# EAGLE design ADC-Board5 (EAGLE 7.7.0)
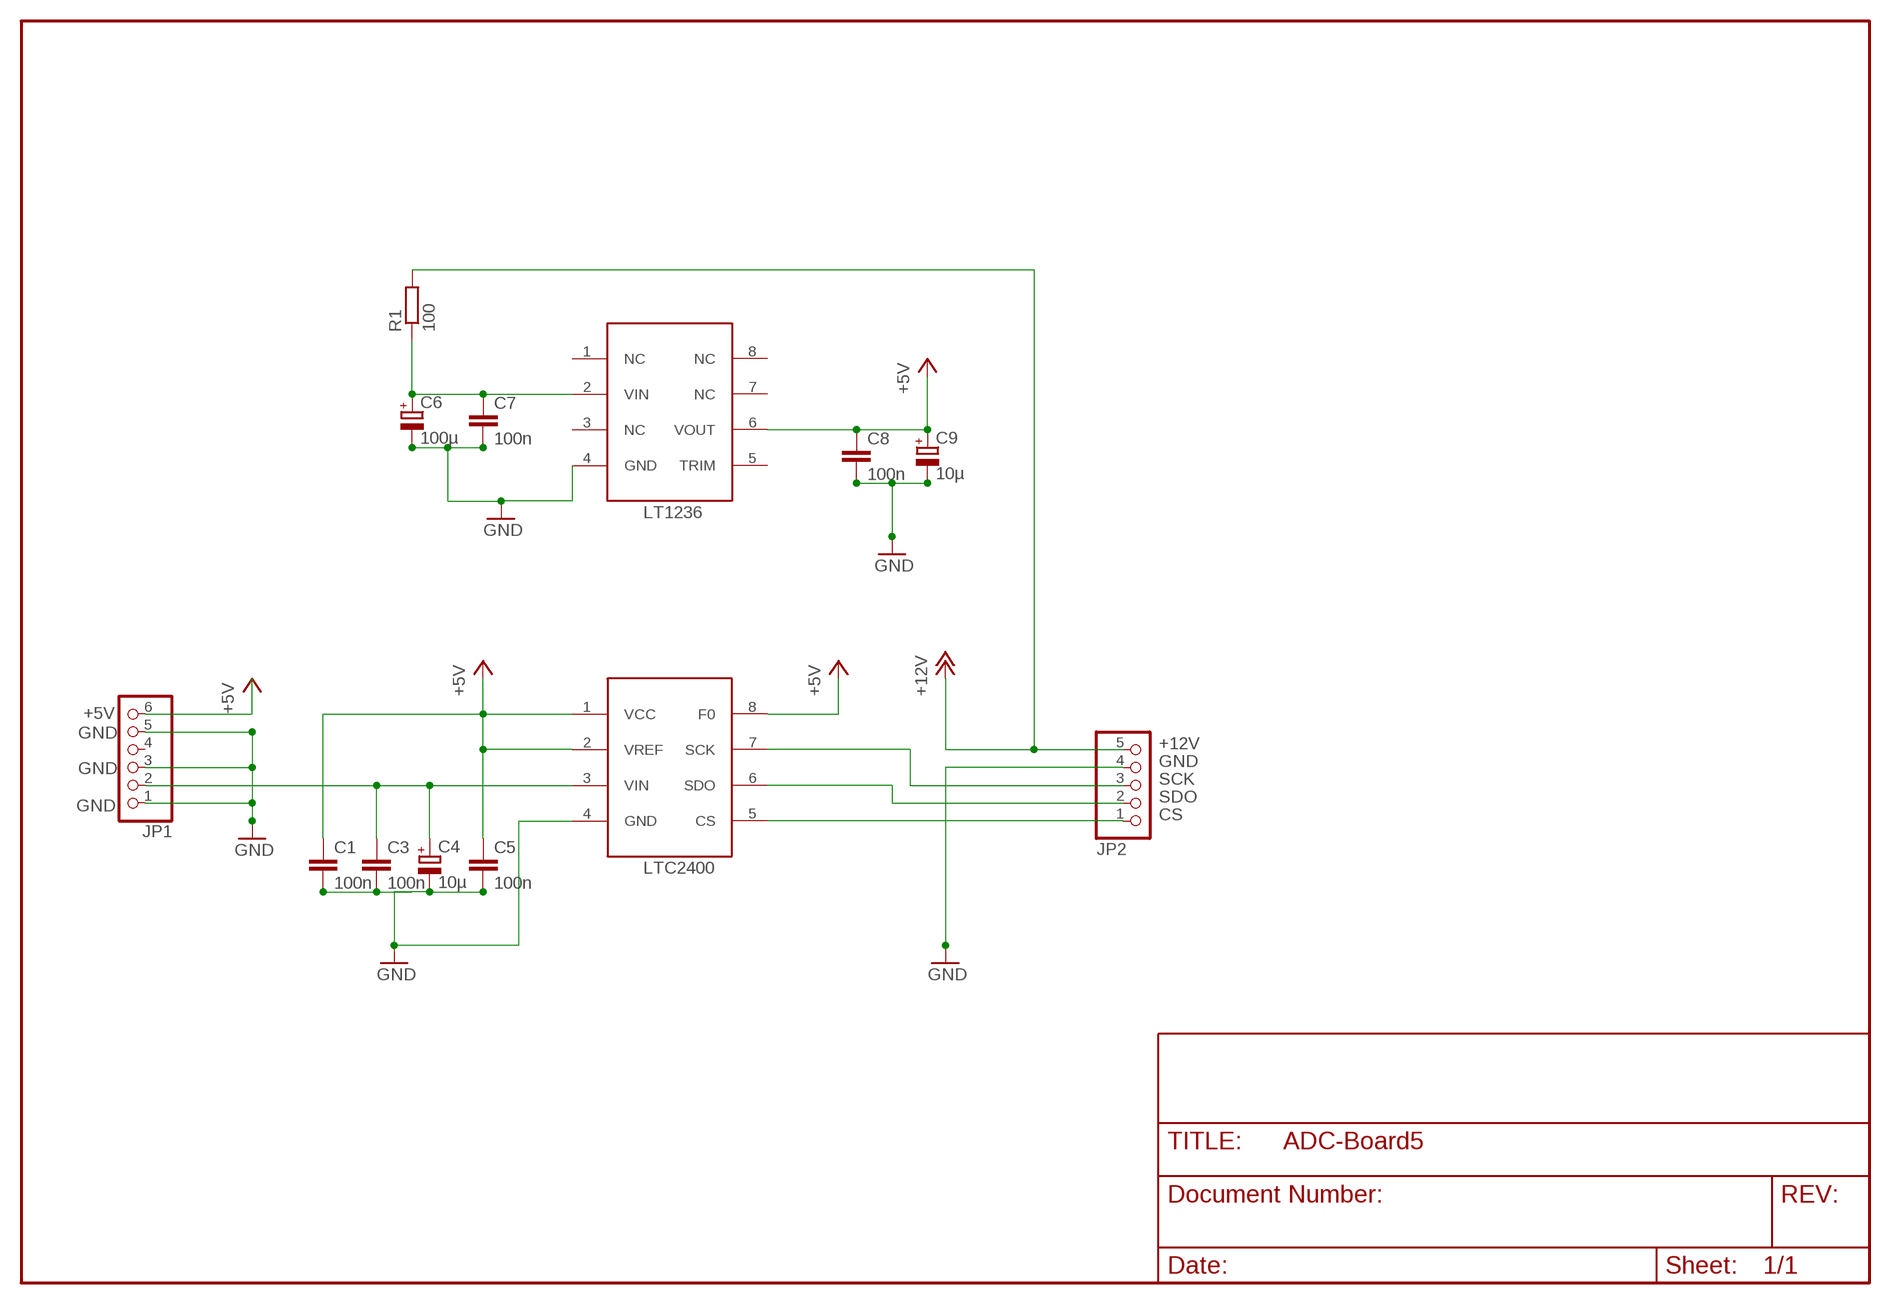
[diagram p0: schematic, sheet 1]

## Parts
C1  100n  C-EUC0805  [C0805]
C3  100n  C-EUC0805  [C0805]
C4  10µ  CPOL-EUC/6032-28R  [C/6032-28R]
C5  100n  C-EUC0805  [C0805]
C6  100µ  CPOL-EUD/7343-31R  [D/7343-31R]
C7  100n  C-EUC0805  [C0805]
C8  100n  C-EUC0805  [C0805]
C9  10µ  CPOL-EUC/6032-28R  [C/6032-28R]
IC1  LT1236  [SO08]
IC2  LTC2400  [SO08]
JP1  PINHD-1X6  [1X06]
JP2  PINHD-1X5  [1X05]
R1  100  R-EU_M1206  [M1206]

## Nets
+5V: C1.1 C5.1 C8.1 C9.+ IC1.6(VOUT) IC2.1(VCC) IC2.2(VREF) IC2.8(F0) JP1.6
+12V: JP2.5 R1.2
CS: IC2.5(CS) JP2.1
GND: C1.2 C3.2 C4.- C5.2 C6.- C7.2 C8.2 C9.- IC1.4(GND) IC2.4(GND) JP1.1 JP1.3 JP1.5 JP2.4
N$5: C3.1 C4.+ IC2.3(VIN) JP1.2
N$10: C6.+ C7.1 IC1.2(VIN) R1.1
SCK: IC2.7(SCK) JP2.3
SDO: IC2.6(SDO) JP2.2
Unconnected: IC1.1(NC) IC1.3(NC) IC1.5(TRIM) IC1.7(NC) IC1.8(NC) JP1.4

## Notes on the sheet
- LT1236
- LTC2400

## Library data of the parts
C1 C3 C5 C7 C8 = Counter:C-EU: CAPACITOR, European symbol
C4 C6 C9 = Counter:CPOL-EU: POLARIZED CAPACITOR, European symbol
IC1 = dirk_ad_smd:LT1236
IC2 = dirk_ad_smd:LTC2400
JP1 = pinhead:PINHD-1X6: PIN HEADER
JP2 = pinhead:PINHD-1X5: PIN HEADER
R1 = Counter:R-EU_: RESISTOR, European symbol

## Board
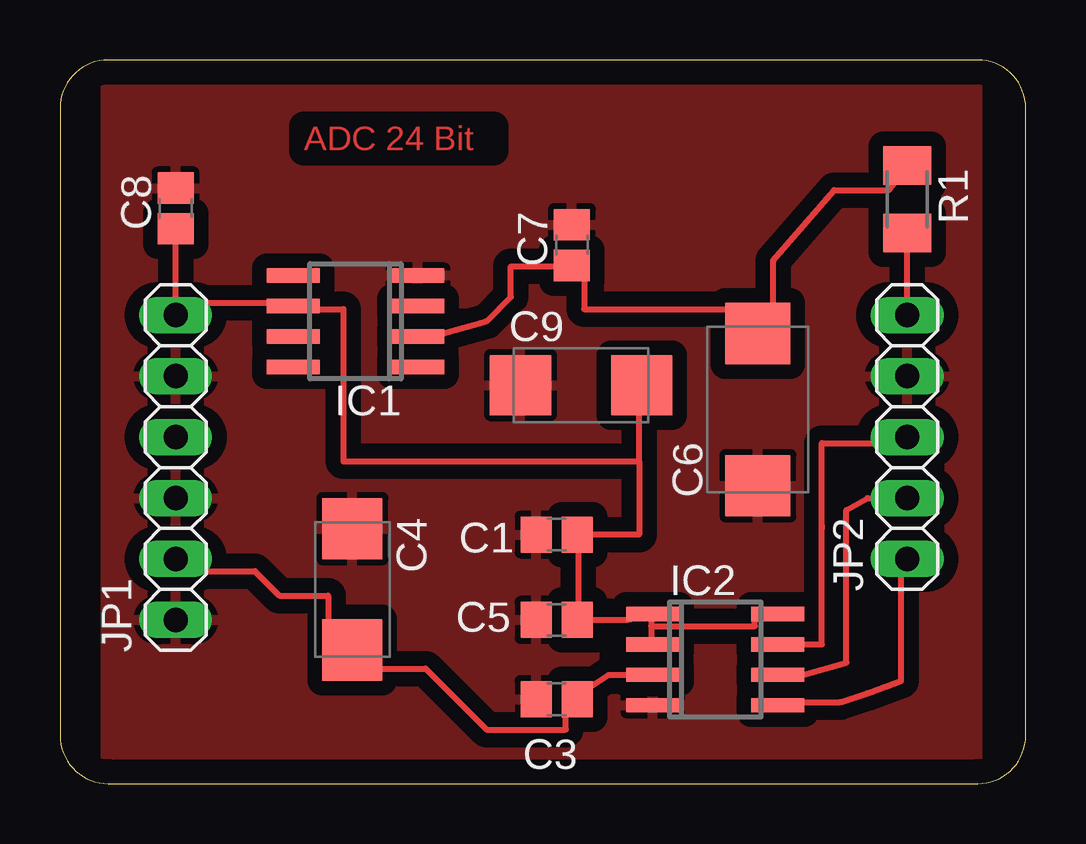
[diagram p1: board, top side]
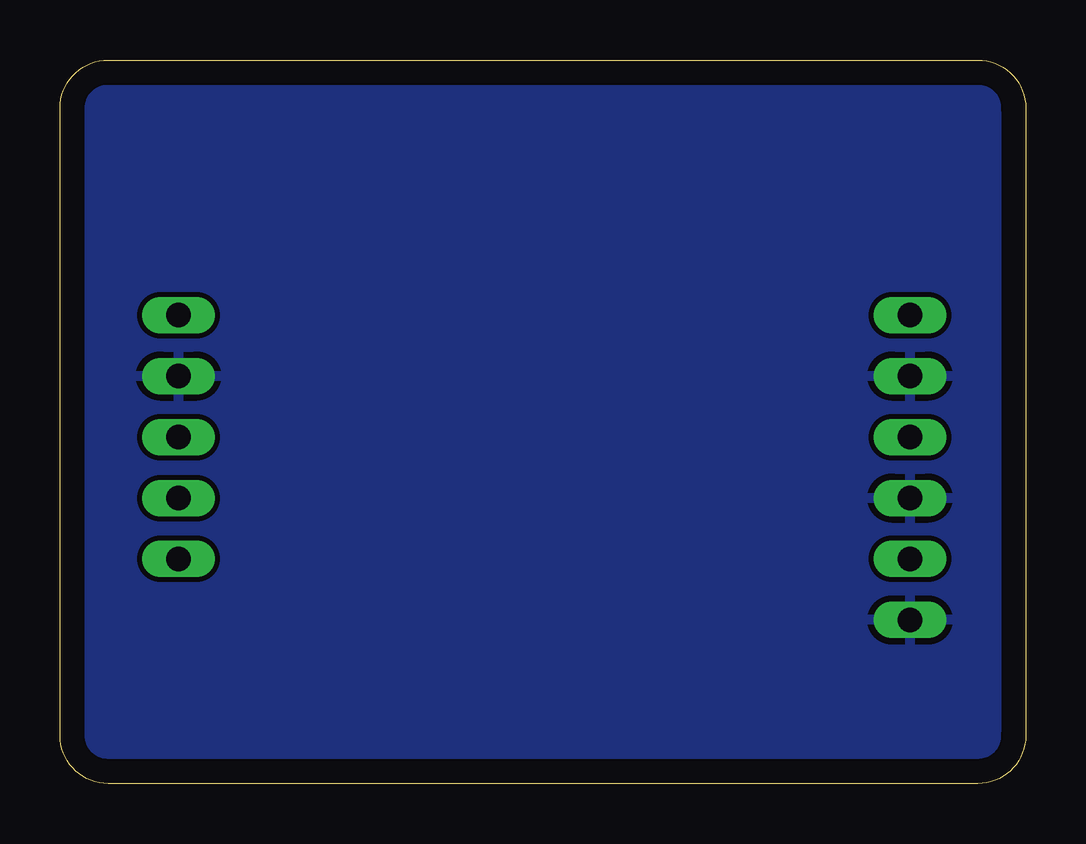
[diagram p2: board, bottom side, seen from below]

Size 40.24 x 30.15 mm. Coordinates in mm from the lower left corner, seen from the top.
Outline: 0,28.15 0,2 arc90 2,0 38.24,0 arc90 40.24,2 40.24,28.15 arc90 38.24,30.15 2,30.15 arc90 0,28.15
Copper layers (1*16): Top 0.035mm / dielectric 1.5mm / Bottom 0.035mm
Design rules "default": minimum track width 10mil, minimum drill 24mil, track to track 8mil, track to pad 8mil, pad to pad 8mil, via to via 8mil, smd to smd 8mil, copper to edge 40mil, drill to drill 8mil, minimum pad ring 10mil, minimum via ring 8mil, stop-mask expansion 4mil, vias tented up to drill 0mil, thermal gap 10mil

### Footprints (pad centres in the part's own frame; a part is rotated, then mirrored left to right if it is on the bottom)
C0805 = smd 1.3 x 1.5: 1 -0.85,0; 2 0.85,0
C/6032-28R = smd 2.55 x 2.5: + 2.525,0; - -2.525,0
D/7343-31R = smd 2.55 x 2.7: + 3.175,0; - -3.175,0
SO08 = smd 0.6 x 2.2: 1 -1.905,-2.6; 2 -0.635,-2.6; 3 0.635,-2.6; 4 1.905,-2.6; 5 1.905,2.6; 6 0.635,2.6; 7 -0.635,2.6; 8 -1.905,2.6
1X06 = drill 1.016 long: 1 -6.35,0; 2 -3.81,0; 3 -1.27,0; 4 1.27,0; 5 3.81,0; 6 6.35,0
1X05 = drill 1.016 long: 1 -5.08,0; 2 -2.54,0; 3 0,0; 4 2.54,0; 5 5.08,0
M1206 = smd 1.6 x 2: 1 -1.4,0; 2 1.4,0

### Placement (x,y rotation side)
C1  20.7,10.38 180 top
C3  20.7,3.52 180 top
C4  12.19,8.09 270 top
C5  20.7,6.82 180 top
C6  29.08,15.58 90 top
C7  21.33,22.44 90 top
C8  4.82,23.96 90 top
C9  21.71,16.6 0 top
IC1  12.31,19.27 90 top
IC2  27.3,5.17 270 top
JP1  4.82,13.17 90 top
JP2  35.3,14.44 90 top
R1  35.3,24.35 270 top

### Tracks (layer width: path | path; a pad name or v marks a point on that pad's centre or on a via)
+5V
  Top 0.254: C8.1 JP1.6 6.09,20.03 8.63,20.03 IC1.6 10.66,19.77 11.81,19.77 11.81,13.42 24.12,13.42 | 24.63,6.57 24.63,6.82 IC2.1 23.62,6.82 C5.1 21.59,7.33 21.59,9.74 C1.1 24.12,10.38 24.12,13.42 | 24.63,6.57 24.63,6.06 IC2.2 | 24.63,6.57 28.95,6.57 28.95,6.82 IC2.8 | 24.12,13.42 24.12,15.46 C9.+
+12V
  Top 0.254: JP2.5 R1.2
CS
  Top 0.254: IC2.5 30.86,3.26 30.86,3.39 32.51,3.39 33.65,3.77 35.05,4.28 35.05,8.85 JP2.1
GND
  pour Top (isolate 0.61): 1.9,29.93 38.22,29.93 38.22,0.34 1.9,0.34
  pour Bottom: 0.25,29.93 39.87,29.93 39.87,0.22 0.25,0.22
N$5
  Top 0.254: IC2.3 22.85,4.53 22.09,4.03 C3.1 21.08,3.01 21.08,2.25 17.77,2.25 15.23,4.79 13.2,4.79 C4.+ 11.17,6.82 11.17,7.84 9.14,7.84 8.12,8.85 6.09,8.85 JP1.2
N$10
  Top 0.254: R1.1 34.54,24.73 32.25,24.73 29.71,21.81 29.71,20.03 C6.+ 27.94,19.77 21.84,19.77 21.84,21.04 C7.1 20.82,21.55 18.79,21.55 18.79,20.28 17.77,19.27 16,18.76 15.74,18.76 IC1.2
SCK
  Top 0.254: 31.74,10.76 31.74,5.8 IC2.7 | 31.74,10.76 31.74,10.63 | 31.74,10.76 31.74,14.19 34.03,14.19 JP2.3
SDO
  Top 0.254: IC2.6 30.98,4.53 32.76,5.04 32.76,11.39 33.65,11.9 JP2.2

### Text on the board
Top: ADC 24 Bit